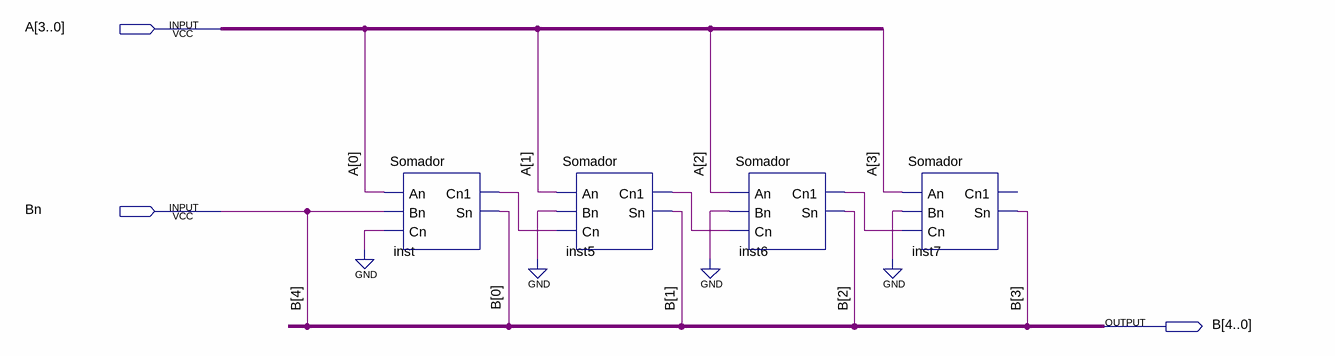
[diagram p0: schematic sheet]
// Quartus schematic SomadorCompleto4x1.bdf as structural Verilog: 4 symbols, 3 pins
module SomadorCompleto4x1 (
  input  [3:0] A,
  input  Bn,
  output [4:0] B
);

  wire inst5_cn1, inst6_cn1, inst_cn1;

  Somador inst (.An(A[0]), .Bn(Bn), .Cn(1'b0), .Cn1(inst_cn1), .Sn(B[0]));
  Somador inst5 (.An(A[1]), .Bn(1'b0), .Cn(inst_cn1), .Cn1(inst5_cn1), .Sn(B[1]));
  Somador inst6 (.An(A[2]), .Bn(1'b0), .Cn(inst5_cn1), .Cn1(inst6_cn1), .Sn(B[2]));
  Somador inst7 (.An(A[3]), .Bn(1'b0), .Cn(inst6_cn1), .Sn(B[3]));  // open: Cn1

  assign B[4] = Bn;
endmodule
